# EAGLE design Pro_Micro (EAGLE 6.5.0)
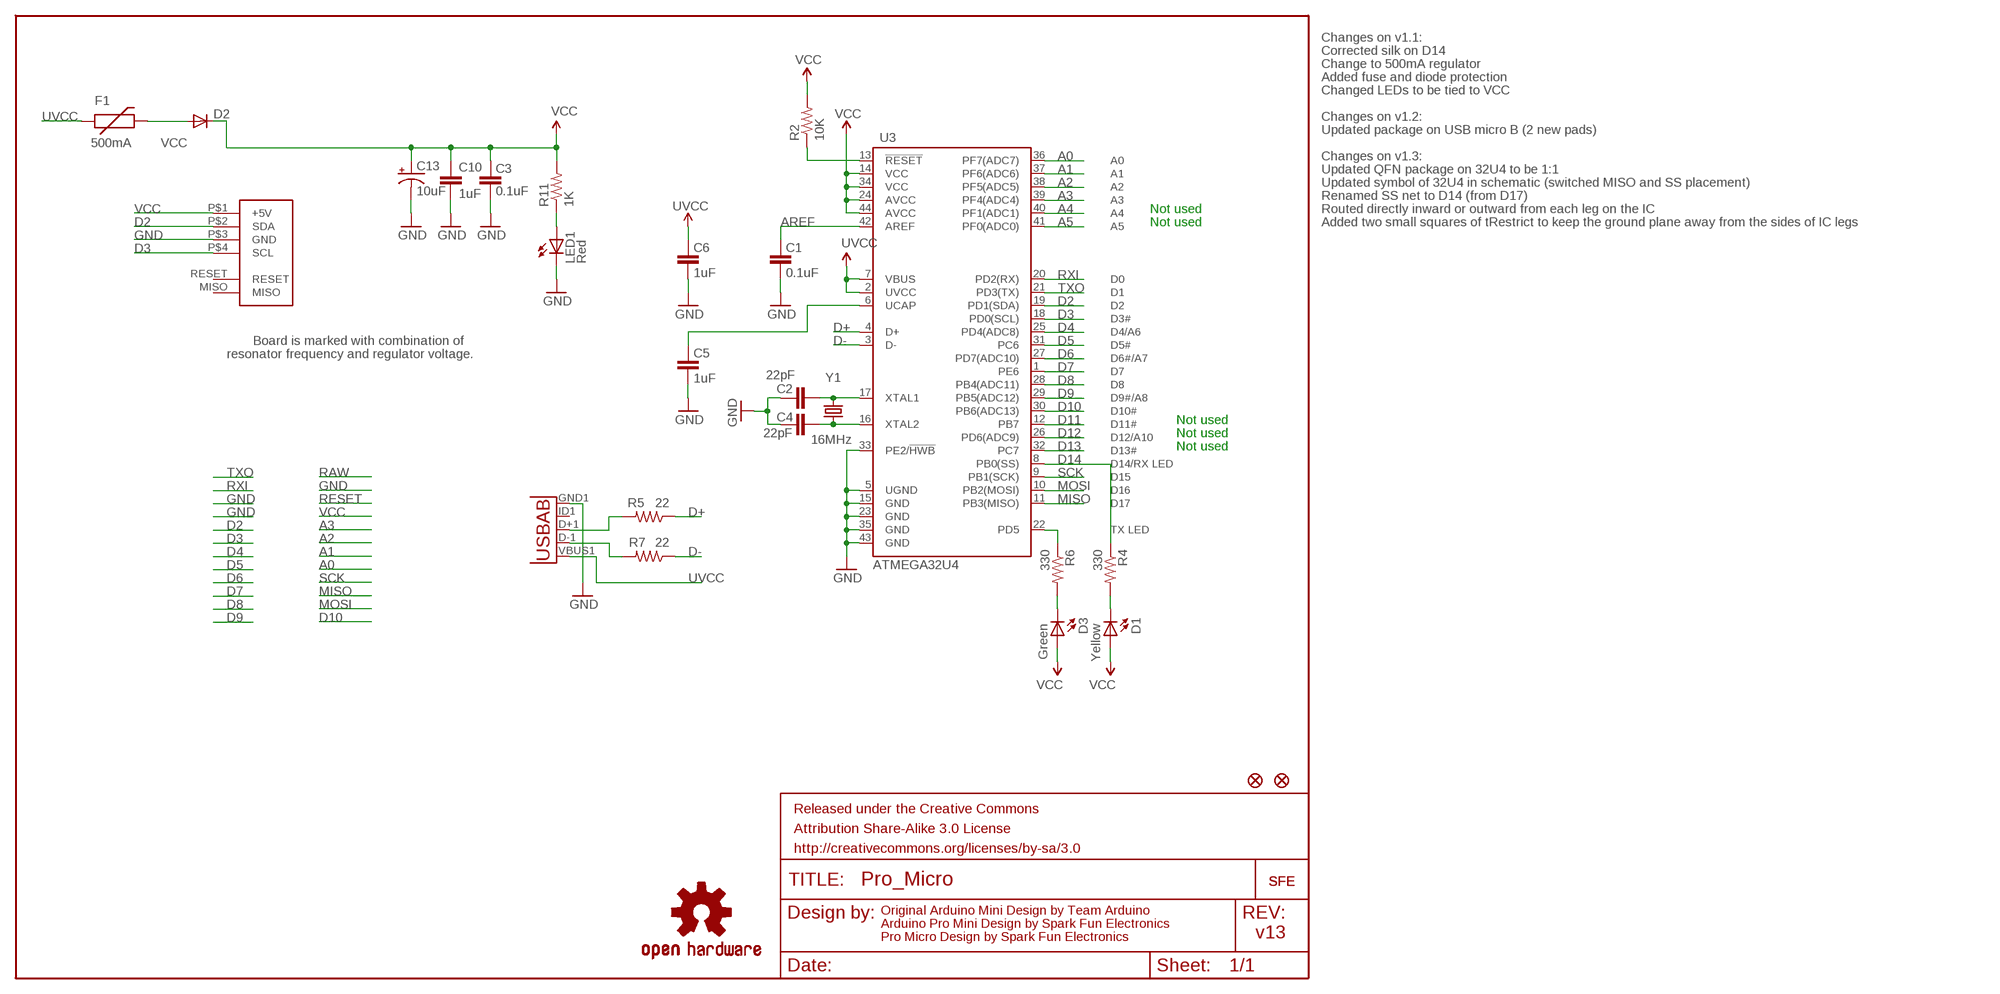
[diagram p0: schematic, sheet 1]

## Parts
C1  0.1uF  CAP0603-CAP  [0603-CAP]
C2  22pF  CAP0603-CAP  [0603-CAP]
C3  0.1uF  CAP0603-CAP  [0603-CAP]
C4  22pF  CAP0603-CAP  [0603-CAP]
C5  1uF  CAP0603-CAP  [0603-CAP]
C6  1uF  CAP0603-CAP  [0603-CAP]
C10  1uF  CAP0603-CAP  [0603-CAP]
C13  10uF  CAP_POL1206  [EIA3216]
D1  Yellow  LED0603  [LED-0603]
D2  DIODESOD  [SOD-323]
D3  Green  LED0603  [LED-0603]
F1  500mA  PTCSMD  [PTC-1206]
FRAME1  FRAME-LETTER  [CREATIVE_COMMONS]
JP1  FIDUCIALUFIDUCIAL  [MICRO-FIDUCIAL]
JP2  FIDUCIALUFIDUCIAL  [MICRO-FIDUCIAL]
LED1  Red  LED0603  [LED-0603]
R2  10K  RESISTOR0603-RES  [0603-RES]
R4  330  RESISTOR0603-RES  [0603-RES]
R5  22  RESISTOR0603-RES  [0603-RES]
R6  330  RESISTOR0603-RES  [0603-RES]
R7  22  RESISTOR0603-RES  [0603-RES]
R11  1K  RESISTOR0603-RES  [0603-RES]
U3  ATMEGA32U4  ATMEGA32U4OUTFAKES  [QFN-44-NOPAD_1:1-OUTFAKES]
U$1  LOGO-SFESK  [SFE-LOGO-FLAME]
U$2  FOOTPRINT  [FOOTPRINT]
U$3  OSHW-LOGOS  [OSHW-LOGO-S]
U$11  LOGO-SFENEW  [SFE-NEW-WEBLOGO]
X1  USB-ABIN&OUT  [USB-AB-MICRO-SMD-V03-IN&OUT]
Y1  16MHz  CRYSTAL5X3  [CRYSTAL-SMD-5X3]

## Nets
A0: U3.36(PF7(ADC7))
A1: U3.37(PF6(ADC6))
A2: U3.38(PF5(ADC5))
A3: U3.39(PF4(ADC4))
A4: U3.40(PF1(ADC1))
A5: U3.41(PF0(ADC0))
AREF: C1.2 U3.42(AREF)
D2: U3.19(PD1(SDA)) U$2.P$2(SDA)
D3: U3.18(PD0(SCL)) U$2.P$4(SCL)
D4: U3.25(PD4(ADC8))
D5: U3.31(PC6)
D6: U3.27(PD7(ADC10))
D7: U3.1(PE6)
D8: U3.28(PB4(ADC11))
D9: U3.29(PB5(ADC12))
D10: U3.30(PB6(ADC13))
D11: U3.12(PB7)
D12: U3.26(PD6(ADC9))
D13: U3.32(PC7)
D14: R4.1 U3.8(PB0(SS))
D+: R5.1 U3.4(D+)
D-: R7.1 U3.3(D-)
GND [vcc]: C1.1 C2.2 C3.1 C4.2 C5.1 C6.1 C10.2 C13.C(-) LED1.C U3.5(UGND) U3.15(GND) U3.23(GND) U3.33(PE2/!HWB) U3.35(GND) U3.43(GND) U$2.P$3(GND) X1.GND1(GND)
MISO: U3.11(PB3(MISO))
MOSI: U3.10(PB2(MOSI))
N$1: C4.1 U3.16(XTAL2) Y1.1
N$2: C2.1 U3.17(XTAL1) Y1.3
N$4: C5.2 U3.6(UCAP)
N$5: D1.C R4.2
N$6: R7.2 X1.D-1(D-)
N$7: D3.C R6.2
N$8: R5.2 X1.D+1(D+)
N$10: D2.2(A) F1.2
N$38: LED1.A R11.1
RESET: R2.1 U3.13(!RESET)
RXI: U3.20(PD2(RX))
SCK: U3.9(PB1(SCK))
TXLED: R6.1 U3.22(PD5)
TXO: U3.21(PD3(TX))
UVCC: C6.2 F1.1 U3.2(UVCC) U3.7(VBUS) X1.VBUS1(VBUS)
VCC: C3.2 C10.1 C13.A(+) D1.A D2.1(C) D3.A R2.2 R11.2 U3.14(VCC) U3.24(AVCC) U3.34(VCC) U3.44(AVCC) U$2.P$1(+5V)
Unconnected: U$2.MISO U$2.RESET X1.ID1(USBID)

## Notes on the sheet
- Changes on v1.1:
- Corrected silk on D14
- Change to 500mA regulator
- Added fuse and diode protection
- Changed LEDs to be tied to VCC
- Changes on v1.2:
- Updated package on USB micro B (2 new pads)
- Changes on v1.3:
- Updated QFN package on 32U4 to be 1:1
- Updated symbol of 32U4 in schematic (switched MISO and SS placement)
- Renamed SS net to D14 (from D17)
- Not used | Routed directly inward or outward from each leg on the IC
- Not used | Added two small squares of tRestrict to keep the ground plane away from the sides of IC legs
- Board is marked with combination of
- resonator frequency and regulator voltage.
- Not used
- Not used
- Not used
- Original Arduino Mini Design by Team Arduino
- Arduino Pro Mini Design by Spark Fun Electronics
- Pro Micro Design by Spark Fun Electronics | v13

## Library data of the parts
C1-C6 C10 = SparkFun:CAP: Capacitor Standard 0603 ceramic capacitor, and 0.1" leaded capacitor.
C13 = SparkFun:CAP_POL: Capacitor Polarized These are standard SMD and PTH capacitors. Normally 10uF, 47uF, and 100uF in electrolytic and tantalum varieties. Always verify the external diameter of the through hole cap, it varies with capacity, voltage, and manufacturer. The EIA devices should be standard.
D1 D3 LED1 = SparkFun:LED: LEDs Standard schematic elements and footprints for 5mm, 3mm, 1206, and 0603 sized LEDs. 5mm - Spark Fun Electronics SKU : COM-00529 (and others)
D2 = SparkFun:DIODE: Diode These are standard reverse protection diodes and small signal diodes. SMA package can handle up to about 1A. SOD-323 can handle about 200mA. What the SOD-323 package when ordering, there are some mfgs out there that are 5-pin packages.
F1 = SparkFun:PTC: Resettable Fuse PTC Resettable Fuse. Spark Fun Electronics SKU : COM-08357
FRAME1 = SparkFun-Aesthetics:FRAME-LETTER: Schematic Frame Standard 8.5x11 US Letter frame
JP1 JP2 = SparkFun:FIDUCIAL: Fiducial Alignment Points Various fiducial points for machine vision alignment.
R2 R4-R7 R11 = SparkFun:RESISTOR: Resistor Basic schematic elements and footprints for 0603, 1206, and PTH resistors.
U3 = Testing:ATMEGA32U4: Atmel 44-pin 8-bit Microcontroller with 32KBytes of ISP Flash and USB Controller
U$1 U$11 = SparkFun:LOGO-SFE: Spark Fun Electronics PCB Logo This is the standard Spark Fun Electronics PCB logo.
U$2 = IntegerLabs:FOOTPRINT
U$3 = SparkFun:OSHW-LOGO: Open Source Hardware Logo This logo indicates the piece of hardware it is found on incorporates a OSHW license and/or adheres to the definition of open source hardware found here: http://freedomdefined.org/OSHW
X1 = Testing:USB-AB: This is a USB AB connector that is compatible with USB OTG. i.e. this connector can serve as a host or device
Y1 = SparkFun:CRYSTAL: Crystals Various standard crystals. Proven footprints. Spark Fun Electronics SKU : COM-00534

## Net classes
0 default: width 0.203 mm

## Board
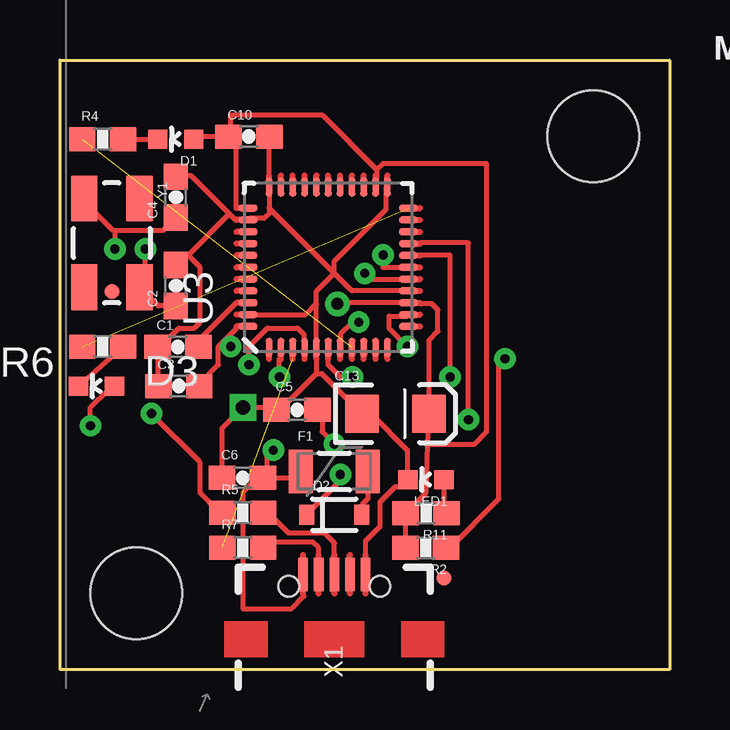
[diagram p1: board, top side]
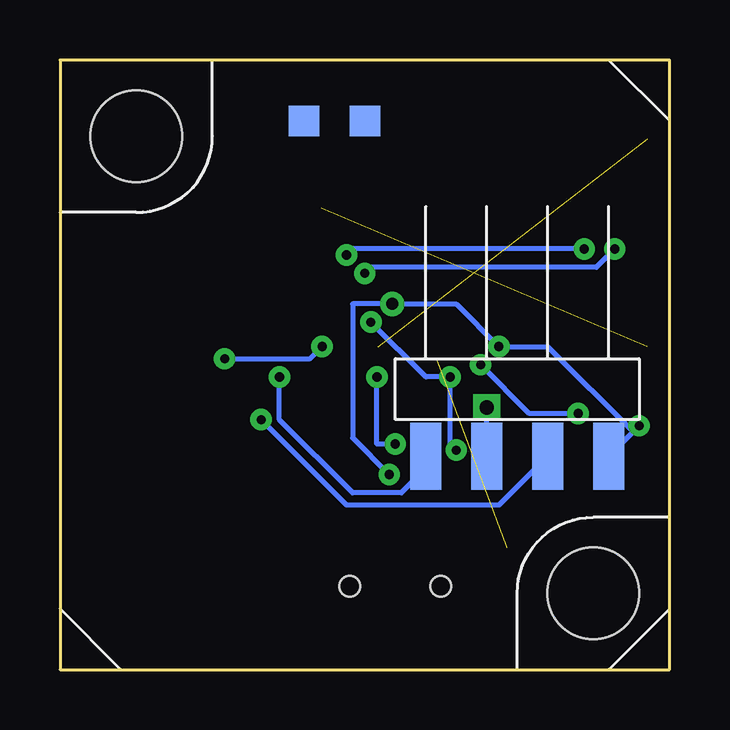
[diagram p2: board, bottom side, seen from below]

Size 25.4 x 25.4 mm. Coordinates in mm from the lower left corner, seen from the top.
Copper layers (1*16): Top 0.035mm / dielectric 1.5mm / Bottom 0.035mm
Design rules "SparkFun *": minimum track width 8mil, minimum drill 15mil, track to track 7mil, track to pad 7mil, pad to pad 7mil, via to via 7mil, smd to smd 7mil, copper to edge 7mil, drill to drill 7mil, minimum pad ring 12mil, minimum via ring 10mil, stop-mask expansion 4mil, vias tented up to drill 20mil, thermal gap 10mil
tRestrict: area -6.1,8.3 to -5.9,8.4; area -2.2,12.3 to -2.1,12.4; area -9.8,9 to -2.7,16.3

### Footprints (pad centres in the part's own frame; a part is rotated, then mirrored left to right if it is on the bottom)
0603-CAP = smd 1.1 x 1: 1 -0.85,0; 2 0.85,0
EIA3216 = smd 1.4 x 1.6: A 1.4,0; C -1.4,0
LED-0603 = smd 0.8 x 0.8: A 0,-0.75; C 0,0.75
SOD-323 = smd 0.63 x 0.83: 1 -1.15,0; 2 1.15,0
PTC-1206 = smd 1 x 1.8: 1 -1.4,0; 2 1.4,0
MICRO-FIDUCIAL = smd 0.635 x 0.635: 1 0,0
0603-RES = smd 1.1 x 1: 1 -0.85,0; 2 0.85,0
QFN-44-NOPAD_1:1-OUTFAKES = smd 0.8 x 0.3: 1 -3.337,2.465; 2 -3.337,1.972; 3 -3.337,1.479; 4 -3.337,0.986; 5 -3.337,0.493; 6 -3.337,0; 7 -3.337,-0.493; 8 -3.337,-0.986; 9 -3.337,-1.479; 10 -3.337,-1.972; 11 -3.337,-2.465; 23 3.337,-2.465; 24 3.337,-1.972; 25 3.337,-1.479; 26 3.337,-0.986; 27 3.337,-0.493; 28 3.337,0; 29 3.337,0.493; 30 3.337,0.986; 31 3.337,1.479; 32 3.337,1.972; 33 3.337,2.465 | smd 0.3 x 0.8: 12 -2.465,-3.337; 13 -1.972,-3.337; 14 -1.479,-3.337; 15 -0.986,-3.337; 16 -0.493,-3.337; 17 0,-3.337; 18 0.493,-3.337; 19 0.986,-3.337; 20 1.479,-3.337; 21 1.972,-3.337; 22 2.465,-3.337; 34 2.465,3.337; 35 1.972,3.337; 36 1.479,3.337; 37 0.986,3.337; 38 0.493,3.337; 39 0,3.337; 40 -0.493,3.337; 41 -0.986,3.337; 42 -1.479,3.337; 43 -1.972,3.337; 44 -2.465,3.337
FOOTPRINT = smd 1.27 x 1.27 bottom: MISO 15.24,22.86; RESET 12.7,22.86 | smd 1.295 x 2.794 bottom: P$1 2.54,8.89; P$2 5.08,8.89; P$3 7.62,8.89; P$4 10.16,8.89 | hole 3.81: 22.225,22.225; 3.175,3.175
USB-AB-MICRO-SMD-V03-IN&OUT = smd 1.4 x 0.4: D+1 2.7,0; D-1 2.7,0.65; GND1 2.7,-1.3; ID1 2.7,-0.65; VBUS1 2.7,1.3 | hole 0.85: 2.2,1.9; 2.2,-1.9
CRYSTAL-SMD-5X3 = smd 1.9 x 1.1: 1 -1.85,-1.15; 2 1.85,-1.15; 3 1.85,1.15; 4 -1.85,1.15

### Placement (x,y rotation side)
C1  4.91,13.45 0 top
C2  4.83,16 90 top
C3  4.95,11.81 0 top
C4  4.83,19.68 90 top
C5  9.88,10.82 0 top
C6  7.61,7.99 0 top
C10  7.87,22.21 0 top
C13  13.98,10.66 0 top
D1  4.83,22.1 90 top
D2  11.43,6.45 0 top
D3  1.52,11.81 90 top
F1  11.43,8.26 0 top
FRAME1  -32.49,-11.43 0 top  (outside the outline)
JP1  2.16,15.75 270 top
JP2  16,3.81 180 top
LED1  15.25,7.91 90 top
R2  15.24,5.08 180 top
R4  1.78,22.1 0 top
R5  7.62,6.53 0 top
R6  1.78,13.46 0 top
R7  7.62,5.08 0 top
R11  15.25,6.52 180 top
U3  11.18,16.76 90 top
U$1  25.91,37.08 90 top  (outside the outline)
U$2  0,0 0 top
U$3  11.68,49.53 90 bottom  (outside the outline)
U$11  16,39.75 90 bottom  (outside the outline)
X1  11.43,1.27 90 top
Y1  2.16,17.78 270 top

### Tracks (layer width: path | path; a pad name or v marks a point on that pad's centre or on a via)
AREF
  Top 0.203: C1.2 5.76,13.7 7.35,15.29
D2  (via drill 0.38)
  Top 0.203: v17.02,10.41 17.02,17.78 14.99,17.78 U3.19
  Bottom 0.203: v17.02,10.41 13.46,6.86 7.11,6.86 U$2.P$2
D3  (via drill 0.38)
  Top 0.203: v16.26,12.19 16.26,17.27 14.99,17.27 U3.18
  Bottom 0.203: v16.26,12.19 16.26,10.41 13.21,7.37 11.18,7.37 10.16,8.38 U$2.P$4
D14  (1 unrouted)
D+  (via drill 0.38)
  Top 0.203: v7.87,12.7 7.87,13.46 8.64,14.22 9.91,14.22 10.16,13.97 10.16,13.46 U3.4 | v3.81,10.67 5.84,8.64 5.84,7.37 6.6,6.6 R5.1
  Bottom 0.203: v7.87,12.7 5.84,10.67 v3.81,10.67
D-  (1 unrouted)
  Top 0.203: R7.1 6.77,4.76
GND  (via drill 0.6)
  Top 0.203: U3.5 10.68,15.24 | 10.68,15.24 10.68,15.76 11.43,16.51 | U3.15 12.16,15.78 11.43,16.51 | U3.33 8.71,19.23 | 8.71,19.23 11.43,16.51 | 8.71,19.23 8.71,19 8.51,18.8 7.9,18.8 U3.35 | 8.71,20.59 C10.2 | 7.35,18.74 7.3,18.74 7.05,18.99 | 7.05,18.99 5.46,20.57 4.87,20.57 C4.2 | C2.2 4.91,16.85 5.33,17.27 | 5.33,17.27 7.05,18.99 | C3.1 4.06,11.85 C1.1 4.18,13.45 4.95,14.22 5.59,14.22 5.84,14.48 5.84,16.76 5.33,17.27 | 10.68,12.95 10.68,12.33 | 10.68,12.33 9.53,11.18 9.38,11.18 C5.1 8.93,10.92 v7.62,10.92 6.76,10.06 C6.1 | 10.68,12.33 10.91,12.33 C13.C 12.96,10.66 14.48,9.14 14.48,7.94 LED1.C 14.21,7.62 13.97,7.62 13.33,6.99 13.33,5.97 12.73,5.36 12.73,4.78 | 11.43,16.51 11.43,17.02 13.59,19.18 13.59,20.05 U3.23 | 7.35,14.79 10.24,14.79 10.68,15.24
  Bottom 0.203: U$2.P$3 v7.62,10.92
N$1  (via drill 0.38)
  Top 0.203: 2.29,18.29 4.28,18.29 C4.1 | Y1.1 1.01,19.5 2.22,18.29 2.29,18.29 | v12.7,16.51 12.7,16.26 14.48,16.26 U3.16 | 2.29,18.29 v2.29,17.53
  Bottom 0.203: v12.7,16.51 12.45,16.76 3.05,16.76 v2.29,17.53
N$2  (via drill 0.38)
  Top 0.203: C2.1 4.09,15.15 Y1.3 3.56,16 v3.56,17.53 | U3.17 13.46,16.76 v13.46,17.27
  Bottom 0.203: v13.46,17.27 13.21,17.53 v3.56,17.53
N$4  (via drill 0.38)
  Top 0.203: v12.19,12.19 11.68,12.19 11.18,12.7 11.18,12.95 | v11.43,9.4 10.92,9.91 10.92,10.67 C5.2
  Bottom 0.203: v12.19,12.19 12.19,9.4 v11.43,9.4
N$5
  Top 0.203: R4.2 D1.C
N$6
  Top 0.203: X1.D-1 10.78,5.07 10.54,5.31 8.67,5.31 8.47,5.11 R7.2
N$7
  Top 0.203: R6.2 D3.C
N$8
  Top 0.203: X1.D+1 11.43,5.28 11.02,5.69 9.53,5.69 8.68,6.53 R5.2
N$10
  Top 0.203: D2.2 12.58,6.87 12.83,7.12 F1.2
N$38
  Top 0.203: R11.1 16,6.62 LED1.A
RESET  (via drill 0.38)
  Top 0.203: v14.48,13.46 13.72,14.22 13.72,14.73 14.48,14.73 U3.13 | v18.54,12.95 18.29,12.7 18.29,7.11 16.26,5.08 R2.1
  Bottom 0.203: v14.48,13.46 14.99,12.95 v18.54,12.95
TXLED  (1 unrouted)
UVCC  (via drill 0.38)
  Top 0.203: 9.9,8.13 F1.1 9.76,7.99 C6.2 | v9.14,12.19 9.14,12.95 9.2,12.95 | v8.89,9.14 8.64,8.89 8.64,8.13 C6.2 | v12.45,14.48 12.19,14.48 11.68,13.97 11.68,13.46 U3.7 | 10.13,3.16 10.16,3.05 9.65,2.54 7.62,2.54 7.62,7.37 8.38,8.13 C6.2
  Bottom 0.203: v8.89,9.14 9.14,9.14 v9.14,12.19 10.16,12.19 v12.45,14.48
VCC  (via drill 0.38, 0.51)
  Top 0.203: 7.02,22.39 C10.1 | 5.63,22.15 D1.A 5.69,22.21 C10.1 | R2.2 14.4,5.09 R11.2 15.25,7.37 15.33,9.39 | 15.33,9.39 C13.A 15.38,13.73 15.75,14.1 15.75,14.99 15.49,15.24 15.05,15.24 15.01,15.29 | 7.35,19.23 7.35,21.89 C10.1 | U3.14 11.6,15.29 v11.56,15.24 | v1.27,10.16 1.27,10.92 2.03,11.68 D3.A | 13.21,20.83 13.21,20.57 U3.24 | 13.21,20.83 10.92,23.11 7.11,23.11 7.11,22.35 C10.1 | 6.86,13.72 6.6,13.46 6.6,12.7 5.84,11.94 C3.2 | 6.86,13.72 7.37,14.22 7.35,14.3 | v11.68,8.13 11.68,7.87 10.41,6.6 D2.1 | v7.11,13.46 6.86,13.72 | 13.21,20.83 13.46,21.08 17.78,21.08 17.78,9.91 17.27,9.4 15.24,9.4 15.33,9.39
  Bottom 0.203: U$2.P$1 1.52,9.91 | v11.68,8.13 13.21,9.65 13.21,15.24 v11.56,15.24 8.89,15.24 v7.11,13.46 5.08,13.46 1.52,9.91 | 1.52,9.91 v1.27,10.16

### Text on the board
Bottom: v13
tPlace: TXO | RAW | GND | RXI | RST | VCC | GND | J1 | GND | A2 | A3 | A1 | 2 | A0 | 15 | 14 | 16 | 10 | 3 | 4 | Pro | 9 | 5 | 6 | 7 | 8 | Micro
bPlace: 3.3V | 5V
tValues: Valid combinations: | 3.3V Reg / 8MHz | 5V Reg / 16MHz | Mark back accordingly
tDocu: N. Seidle, revised by P. Lewis